# EAGLE design simpleDTMF (EAGLE 4.16)
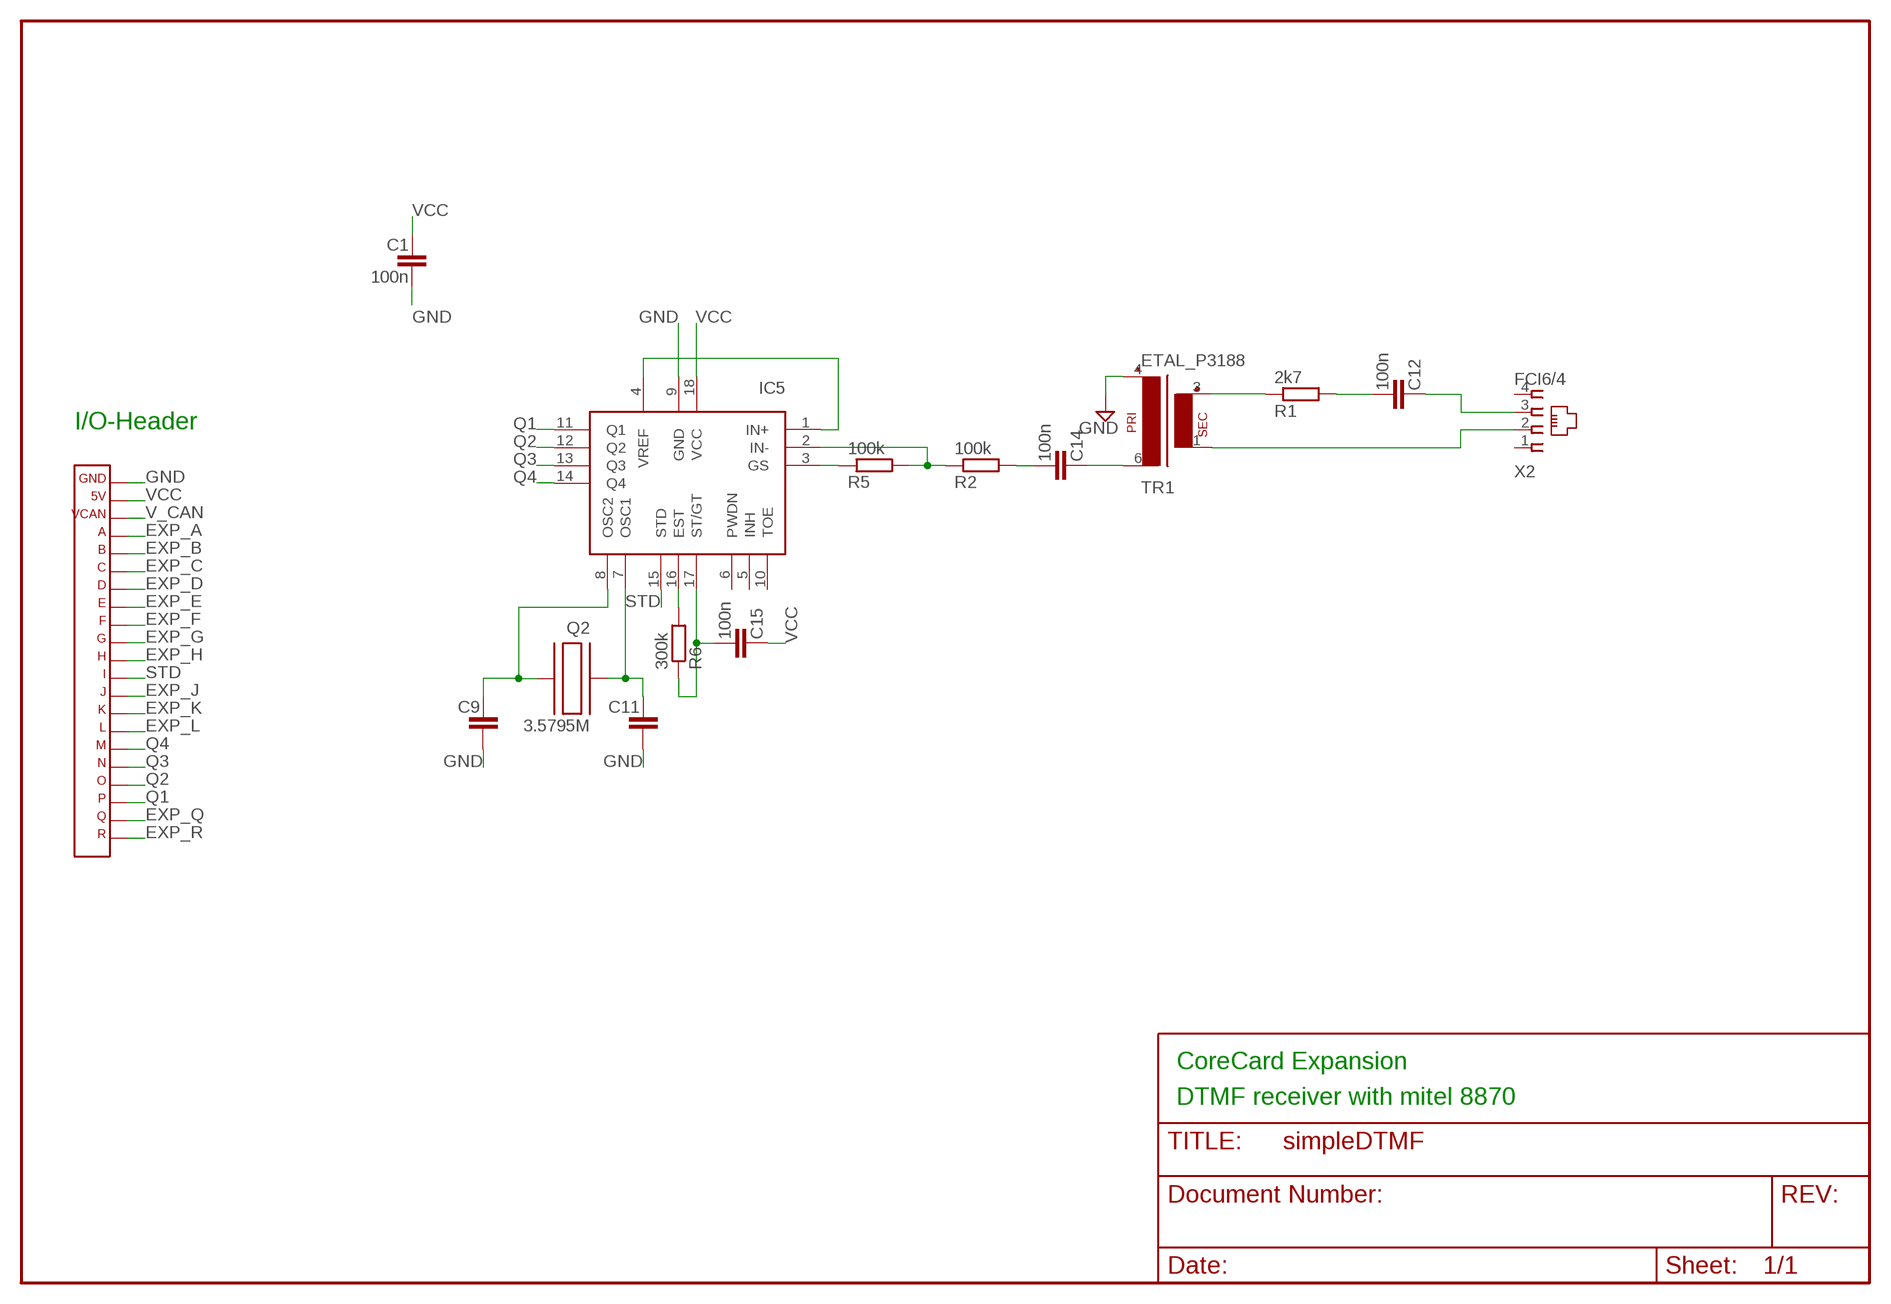
[diagram p0: schematic, sheet 1]

## Parts
C1  100n  C-EUC0603  [C0603]
C9  C-EUC0603  [C0603]
C11  C-EUC0603  [C0603]
C12  100n  C-EUC0805  [C0805]
C14  100n  C-EUC0805  [C0805]
C15  100n  C-EUC0805  [C0805]
IC5  MT8870SO14  [SO18]
Q2  3.5795M  C-MAC-LFA147E  [SMD]
R1  2k7  R-EUR0805  [R0805]
R2  100k  R-EUR0805  [R0805]
R5  100k  R-EUR0805  [R0805]
R6  300k  R-EUR0805  [R0805]
TR1  ETAL_P3188  [ETAL_P3188]
X2  FCI6/4  [FCI6/4]
X3  CORE_IOHEADEXP  [CORE_IOHEAD_NOSILC]

## Nets
EXP_A: X3.4
EXP_B: X3.5
EXP_C: X3.6
EXP_D: X3.7
EXP_E: X3.8
EXP_F: X3.9
EXP_G: X3.10
EXP_H: X3.11
EXP_J: X3.13
EXP_K: X3.14
EXP_L: X3.15
EXP_Q: X3.20
EXP_R: X3.21
GND: C1.2 C9.2 C11.2 IC5.9(GND) TR1.4 X3.1
N$3: C11.1 IC5.7(OSC1) Q2.P$1
N$4: C9.1 IC5.8(OSC2) Q2.P$2
N$5: IC5.16(EST) R6.2
N$6: C15.2 IC5.17(ST/GT) R6.1
N$9: R1.1 TR1.3
N$10: C12.2 R1.2
N$11: C12.1 X2.3
N$14: TR1.1 X2.2
N$15: C14.1 TR1.6
N$16: C14.2 R2.2
N$17: IC5.2(IN-) R2.1 R5.2
N$18: IC5.3(GS) R5.1
N$19: IC5.1(IN+) IC5.4(VREF)
Q1: IC5.11(Q1) X3.19
Q2: IC5.12(Q2) X3.18
Q3: IC5.13(Q3) X3.17
Q4: IC5.14(Q4) X3.16
STD: IC5.15(STD) X3.12
V_CAN: X3.3
VCC: C1.1 C15.1 IC5.18(VCC) X3.2
Unconnected: IC5.5(INH) IC5.6(PWDN) IC5.10(TOE) X2.1 X2.4

## Notes on the sheet
- I/O-Header
- CoreCard Expansion
- DTMF receiver with mitel 8870

## Library data of the parts
C1 C9 C11 C12 C14 C15 = rcl:C-EU
IC5 = mitel-mt8870:MT8870
Q2 = hc49-4h-smx:C-MAC-LFA147E
R1 R2 R5 R6 = rcl:R-EU
TR1 = etal_trafo:ETAL_P3188
X2 = fci-modular:FCI6/4
X3 = expboard:CORE_IOHEAD: CoreCard IO-header for expansion cards

## Board
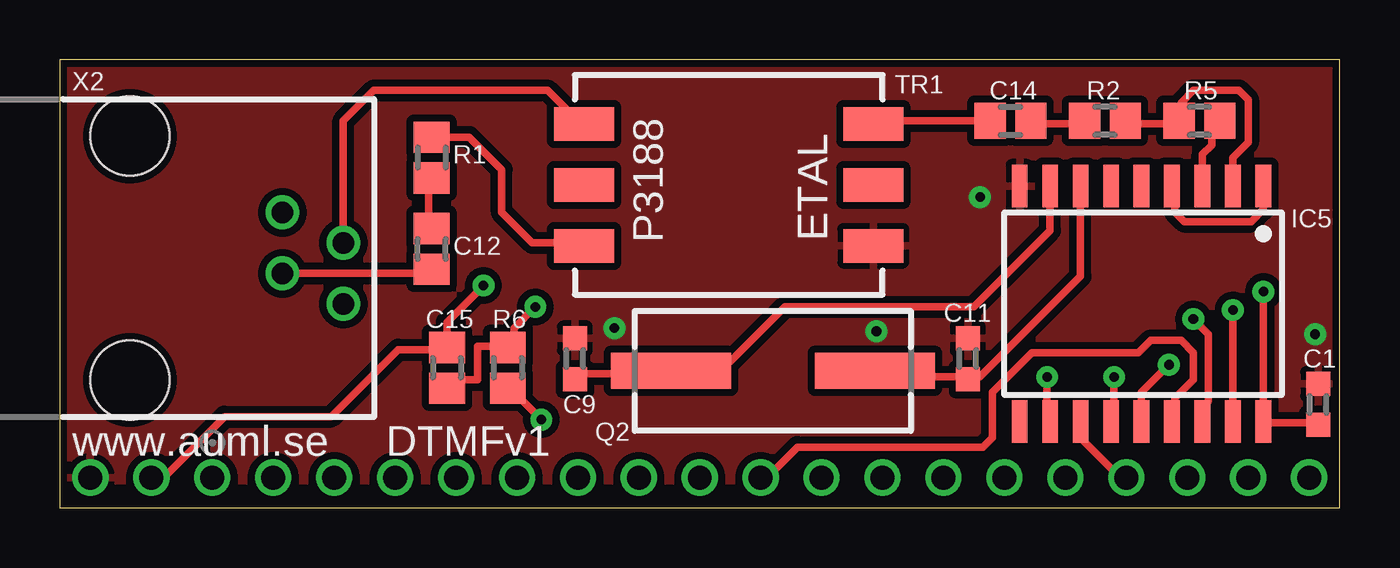
[diagram p1: board, top side]
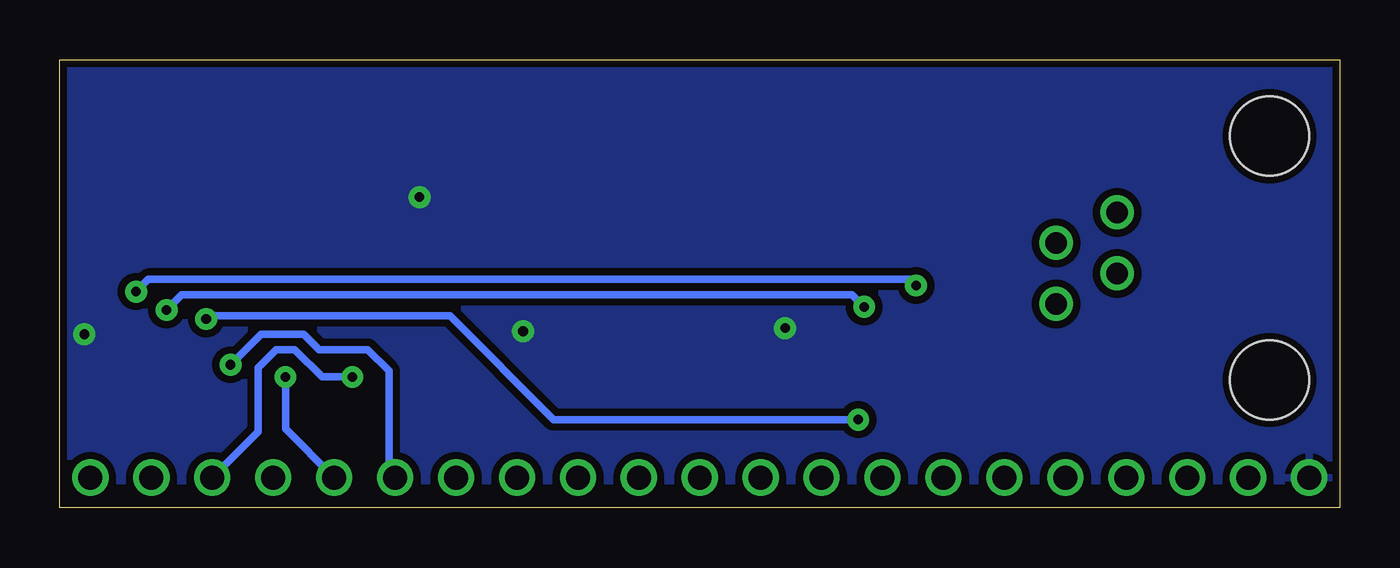
[diagram p2: board, bottom side, seen from below]

Size 53.34 x 18.67 mm. Coordinates in mm from the lower left corner, seen from the top.
Outline: 0,0 53.34,0 53.34,18.67 0,18.67 0,0
Copper layers (1*16): Top 0.035mm / dielectric 1.5mm / Bottom 0.035mm
Design rules "default": minimum track width 10mil, minimum drill 0.4mm, track to track 10mil, track to pad 10mil, pad to pad 10mil, via to via 10mil, smd to smd 8mil, copper to edge 10mil, drill to drill 8mil, minimum pad ring 10mil, minimum via ring 10mil, stop-mask expansion 4mil, vias tented up to drill 18mil, thermal gap 10mil

### Footprints (pad centres in the part's own frame; a part is rotated, then mirrored left to right if it is on the bottom)
C0603 = smd 1 x 1: 1 -0.85,0; 2 0.85,0
C0805 = smd 1.3 x 1.5: 1 -0.85,0; 2 0.85,0
SO18 = smd 0.66 x 1.778: 1 -6.985,-4.902; 2 -5.715,-4.902; 3 -4.445,-4.902; 4 -3.175,-4.902; 5 -1.905,-4.902; 6 -0.635,-4.902; 7 0.635,-4.902; 8 1.905,-4.902; 9 3.175,-4.902; 10 3.175,4.902; 11 1.905,4.902; 12 0.635,4.902; 13 -0.635,4.902; 14 -1.905,4.902; 15 -3.175,4.902; 16 -4.445,4.902; 17 -5.715,4.902; 18 -6.985,4.902
SMD = smd 5 x 1.5: P$1 4.25,0; P$2 -4.25,0
R0805 = smd 1.3 x 1.5: 1 -0.85,0; 2 0.85,0
ETAL_P3188 = smd 1.4 x 2.5: 1 0,-5.08; 2 2.54,-5.08; 3 5.08,-5.08; 4 5.08,6.985; 5 2.54,6.985; 6 0,6.985
FCI6/4 = drill 0.9 round: 1 -8.636,-2.794; 2 -7.366,-0.254; 3 -6.096,-2.794; 4 -4.826,-0.254 | hole 3.3: -11.811,-9.144; -1.651,-9.144
CORE_IOHEAD_NOSILC = drill 1 round: 1 25.4,0; 2 22.86,0; 3 20.32,0; 4 17.78,0; 5 15.24,0; 6 12.7,0; 7 10.16,0; 8 7.62,0; 9 5.08,0; 10 2.54,0; 11 0,0; 12 -2.54,0; 13 -5.08,0; 14 -7.62,0; 15 -10.16,0; 16 -12.7,0; 17 -15.24,0; 18 -17.78,0; 19 -20.32,0; 20 -22.86,0; 21 -25.4,0

### Placement (x,y rotation side)
C1  52.45,4.32 90 top
C9  21.46,6.22 90 top
C11  37.85,6.22 90 top
C12  15.49,10.79 90 top
C14  39.62,16.13 0 top
C15  16.13,5.84 270 top
IC5  43.18,8.51 180 top
Q2  29.72,5.71 0 top
R1  15.49,14.61 270 top
R2  43.56,16.13 180 top
R5  47.5,16.13 180 top
R6  18.67,5.84 270 top
TR1  26.92,16 270 top
X2  12.06,3.68 270 top
X3  26.67,1.27 0 bottom

### Tracks (layer width: path | path; a pad name or v marks a point on that pad's centre or on a via)
GND  (via drill 0.4)
  other vias: 38.35,12.95 52.32,7.24 34.04,7.37 23.11,7.49
  pour Bottom (isolate 0.305, rank 3): 0,18.67 53.34,18.67 53.34,1.14 0,1.14
  pour Top (isolate 0.305, rank 3): 0,18.67 53.34,18.67 53.34,1.14 0,1.14
N$3
  Top 0.305: Q2.P$1 35.31,5.71 35.56,5.46 37.72,5.46 37.85,5.33 C11.1 38.01,5.37 38.1,5.46 38.35,5.46 42.55,9.65 IC5.7
N$4
  Top 0.305: C9.1 21.46,5.59 25.27,5.59 25.4,5.71 Q2.P$2 26.92,5.71 27.3,6.1 27.94,6.1 30.23,8.38 38.1,8.38 41.27,11.56 IC5.8
N$5  (via drill 0.4)
  Top 0.305: 18.54,5.21 R6.2 18.71,4.95 18.8,4.95 v20.07,3.68 | 47.62,3.56 IC5.16 47.75,3.73 47.75,4.32 47.88,4.45 47.88,7.24 v47.24,7.87
  Bottom 0.305: v47.24,7.87 47.12,8 37.08,8 32.77,3.68 v20.07,3.68
N$6  (via drill 0.4)
  Top 0.305: 16.26,4.95 C15.2 16.34,5.33 17.4,5.33 17.4,6.73 18.54,6.73 R6.1 18.71,6.73 18.92,6.73 18.92,7.49 v19.81,8.38 | v48.9,8.26 IC5.17
  Bottom 0.305: v48.9,8.26 48.26,8.89 20.32,8.89 v19.81,8.38
N$9
  Top 0.305: R1.1 17.06,15.46 18.41,14.1 18.41,12.32 19.68,11.05 21.72,11.05 TR1.3
N$10
  Top 0.305: C12.2 15.41,11.64 15.37,11.68 15.37,13.59 15.49,13.72 R1.2
N$11
  Top 0.305: C12.1 15.49,9.91 15.37,9.78 X2.3
N$14
  Top 0.305: X2.2 11.81,16.13 13.08,17.4 20.32,17.4 21.72,16 TR1.1
N$15
  Top 0.305: TR1.6 34.04,16.13 C14.1
N$16
  Top 0.305: C14.2 40.47,16.04 40.51,16 42.55,16 42.67,16.13 R2.2
N$17
  Top 0.305: R2.1 44.41,16.04 44.45,16 46.48,16 46.61,16.13 R5.2 46.65,16.17 46.74,16.26 46.74,16.89 47.24,17.4 49.15,17.4 49.53,17.02 49.53,15.24 48.9,14.61 IC5.2
N$18
  Top 0.305: R5.1 48.35,15.96 48.01,15.62 48.01,15.11 47.62,14.73 47.62,13.59 47.75,13.46 47.7,13.41 IC5.3
N$19
  Top 0.305: IC5.4 46.35,12.95 46.48,12.83 46.48,12.32 46.86,11.94 49.66,11.94 50.16,12.45 IC5.1 50.16,13.46
Q1  (via drill 0.4)
  Top 0.305: IC5.11 41.27,4.06 41.15,4.19 v41.15,5.46
  Bottom 0.305: v41.15,5.46 42.42,5.46 43.56,6.6 44.32,6.6 45.09,5.84 45.09,3.17 X3.19
Q2
  Top 0.305: IC5.12 42.55,4.06 42.42,4.19 42.42,3.05 44.2,1.27 X3.18
Q3  (via drill 0.4)
  Top 0.305: IC5.13 43.81,4.19 43.94,4.32 v43.94,5.46
  Bottom 0.305: v43.94,5.46 43.94,3.3 X3.17
Q4  (via drill 0.4)
  Top 0.305: v46.23,5.97 45.09,4.83 IC5.14
  Bottom 0.305: v46.23,5.97 44.96,7.24 43.18,7.24 42.55,6.6 40.51,6.6 39.62,5.71 39.62,1.52 X3.16
STD
  Top 0.305: IC5.15 46.48,3.73 46.48,4.57 47.24,5.33 47.24,6.48 46.74,6.99 45.47,6.99 44.96,6.48 40.51,6.48 38.86,4.83 38.86,2.92 38.48,2.54 30.73,2.54 29.46,1.27 X3.12
VCC  (via drill 0.4)
  Top 0.305: X3.2 4.32,1.27 6.86,3.81 11.3,3.81 14.1,6.6 16.26,6.6 16.17,6.69 C15.1 16.13,7.75 v17.65,9.27 | C1.1 52.24,3.68 52.2,3.68 52.07,3.56 50.16,3.56 | 50.16,3.56 IC5.18 | v50.16,9.02 50.16,3.56
  Top 0.406: IC5.18 50.16,3.68
  Bottom 0.305: v50.16,9.02 49.66,9.53 17.78,9.53 17.65,9.4 v17.65,9.27

### Text on the board
tPlace: www.auml.se | DTMF | v1
Document: Top is component side | Expansion will be mounted bottom to bottom with CoreCard
tDocu: - | + | A | B | I | L | M | N | O | P | Q | R